# Altium schematic sheet dht_bme280.SchDoc
size A
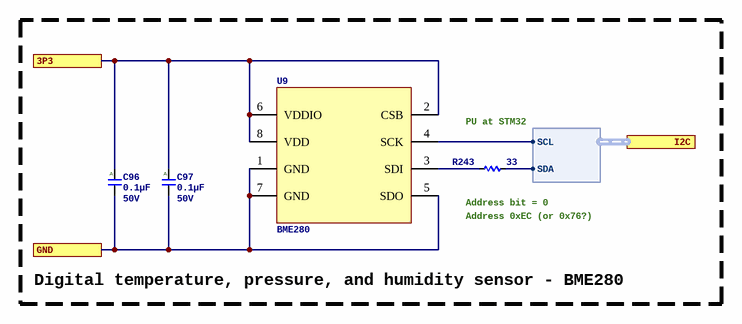
[diagram p0: dht_bme280.SchDoc]

## Parts
C96  Capacitance: 0.1µF  Voltage - Rated: 50V  [C0402_0.55MM]  (hidden comment: CGA2B3X7R1H104M050BB)
C97  Capacitance: 0.1µF  Voltage - Rated: 50V  [C0402_0.55MM]  (hidden comment: CGA2B3X7R1H104M050BB)
R243  Resistance: 33  [R0402_0.40MM]  (hidden comment: ERJ-2RKF33R0X)
U9  BME280  [BOSCH_BME280]

## Ports
3P3, GND, I2C (harness I2C)

## Harnesses
I2C: SCL, SDA

## Nets
3P3: C96.1 C97.1 U9.2(CSB) U9.6(VDDIO) U9.8(VDD) ; port 3P3
GND: C96.2 C97.2 U9.1(GND) U9.5(SDO) U9.7(GND) ; port GND
NetR243_1: R243.1 ; port I2C.SDA
NetR243_2: R243.2 U9.3(SDI)
NetU9_4: U9.4(SCK) ; port I2C.SCL

## Notes on the sheet
- PU at STM32
- Address 0xEC (or 0x76?)
- (near R243) Address bit = 0
- Digital temperature, pressure, and humidity sensor - BME280
- (in symbol CGA2B3X7R1H104M050BB) A

## Library data of the parts
C96 C97 = CGA2B3X7R1H104M050BB: CAP CER 0.1UF 50V X7R 0402; Manufacturer: TDK Corporation; Unit Price (USD): 0.17; Tolerance: ±20%; ComponentLink1URL: https://product.tdk.com/info/en/catalog/datasheets/mlcc_automotive_general_en.pdf?ref_disty=digikey; ComponentLink1Description: Series Datasheet; Series: CGA; Part Status: Active; Temperature Coefficient: X7R; Operating Temperature: -55°C ~ 125°C; Applications: AEC-Q200; Mounting Type: Surface Mount, MLCC; Package / Case: 0402 (1005 Metric); Size / Dimension: 0.039" L x 0.020" W (1.00mm x 0.50mm); Thickness (Max): 0.022" (0.55mm); Supplier 1: Digikey; Supplier Part Number 1: 445-12271-1-ND; Manufacturer Part Number: CGA2B3X7R1H104M050BB
R243 = ERJ-2RKF33R0X: RES SMD 33 OHM 1% 1/10W 0402; Manufacturer: Panasonic Electronic Components; Unit Price (USD): 0.1; Power (Watts): 0.1W, 1/10W; Temperature Coefficient: ±100ppm/°C; ComponentLink1Description: Datasheet; ComponentLink1URL: https://industrial.panasonic.com/cdbs/www-data/pdf/RDA0000/AOA0000C304.pdf; Series: ERJ; Tolerance: ±1%; Composition: Thick Film; Features: Automotive AEC-Q200; Operating Temperature: -55°C ~ 155°C; Package / Case: 0402 (1005 Metric); Supplier Device Package: 0402; Size / Dimension: 0.039" L x 0.020" W (1.00mm x 0.50mm); Height - Seated (Max): 0.016" (0.40mm); Supplier 1: Digikey; Supplier Part Number 1: P33.0LCT-ND; Manufacturer Part Number: ERJ-2RKF33R0X
U9 = DHT_SENSOR_BME280: Pressure, Temperature and Humidity Sensor Digital Output 1.8V 8-Pin LGA T/R; Manufacturer: Bosch Tools; Supplier 1: Digikey; Supplier Part Number 1: 828-1063-1-ND; Manufacturer Part Number: BME280; ComponentLink1Description: Datasheet; ComponentLink1URL: https://www.bosch-sensortec.com/media/boschsensortec/downloads/datasheets/bst-bme280-ds002.pdf; Supplier 2: LCSC; Supplier Part Number 2: C92489